# EAGLE design puck (EAGLE 7.5.0)
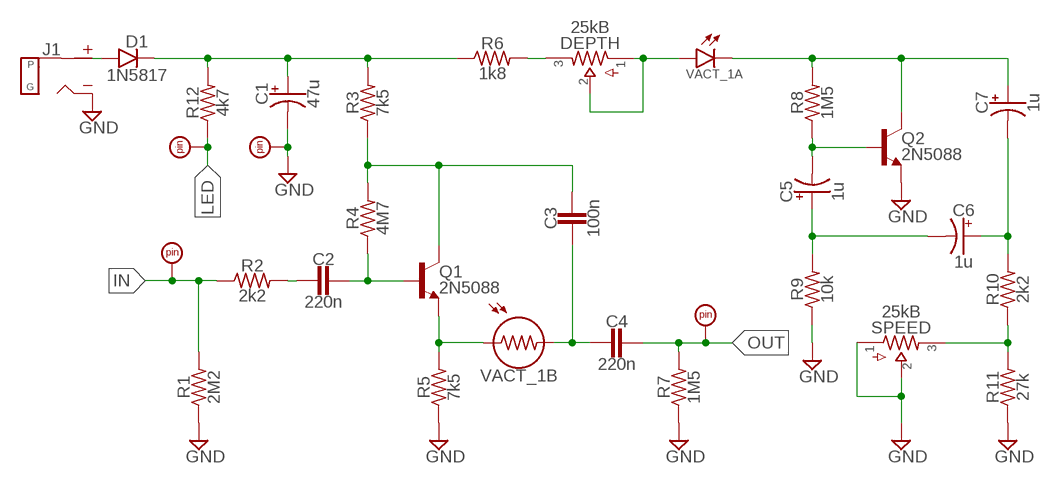
[diagram p0: schematic, sheet 1]

## Parts
C1  47u  0501  [050_020_1]
C2  220n  CER/FILM2  [050X030_025_2]
C3  100n  CER/FILM2  [050X030_025_2]
C4  220n  CER/FILM2  [050X030_025_2]
C5  1u  0500  [050_020]
C6  1u  0500  [050_020]
C7  1u  0500  [050_020]
D1  1N5817  DO41.3  [DO41-3]
DEPTH  25kB  POTSTRIM  [2262_TRIM]
GND  PADRND  [ROUND]
IN  PADSQR  [SQUARE]
J1  DC_MONO  [DC]
LED  PADRND  [ROUND]
OUT  PADSQR  [SQUARE]
Q1  2N5088  [TO92-]
Q2  2N5088  [TO92-]
R1  2M2  R_.3B  [R0207/3]
R2  2k2  R_.3B  [R0207/3]
R3  7k5  R_.3B  [R0207/3]
R4  4M7  R_.3B  [R0207/3]
R5  7k5  R_.3B  [R0207/3]
R6  1k8  R_.3B  [R0207/3]
R7  1M5  R_.3B  [R0207/3]
R8  1M5  R_.3B  [R0207/3]
R9  10k  R_.3B  [R0207/3]
R10  2k2  R_.3B  [R0207/3]
R11  27k  R_.3B  [R0207/3]
R12  4k7  R_.3B  [R0207/3]
SPEED  25kB  POTSSMALL_PADS  [PADS_SMALL]
VACT_1  VACTROL  [_LDR]

## Nets
GND: C1.- GND.1 J1.S(SLEEVE) Q2.3(E) R1.1 R5.1 R7.1 R9.1 R11.1 SPEED.1 SPEED.2
IN: IN.1 R1.2 R2.1
LED: LED.1 R12.1
N$1: D1.A J1.T(TIP)
N$2: C1.+ D1.C R3.2 R6.1 R12.2
N$3: C3.1 Q1.1(C) R3.1 R4.2
N$4: C2.1 Q1.2(B) R4.1
N$5: C7.+ Q2.1(C) R8.2 VACT_1.CATHODE(A:CATHODE)
N$6: C2.2 R2.2
N$7: DEPTH.3 R6.2
N$8: DEPTH.1 DEPTH.2 VACT_1.ANODE(A:ANODE)
N$9: C5.- Q2.2(B) R8.1
N$10: Q1.3(E) R5.2 VACT_1.1
N$11: C3.2 C4.2 VACT_1.2
N$12: C6.+ C7.- R10.2
N$13: C5.+ C6.- R9.2
N$14: R10.1 R11.2 SPEED.3
OUT: C4.1 OUT.1 R7.2

## Library data of the parts
C1 C5-C7 = capacitors-elec:050: 0.22 - 100uF Xicon values at Mouser.com: 10V: 10 - 100uF; 16V: 2.2 - 47uF; 25V: 0.47 - 47uF; 50V: 0.22 - 22uF
C2-C4 = capacitors-film:CER/FILM: 47 - 120pF Xicon Ceramic Disc 2.5mm lead spacing
D1 = diodes:DO41: DO-41 Package Diodes: 1N4001 - 1N40019 Zener Diodes: 1N4728 - 1N4764
DEPTH SPEED = potentiometers:POTS
GND IN LED OUT = supply pins:PAD
J1 = jacks:DC_MONO
Q1 Q2 = transistors:2N5088: NPN Transistor
R1-R12 = resistors:R_
VACT_1 = vactrol:VACTROL

## Board
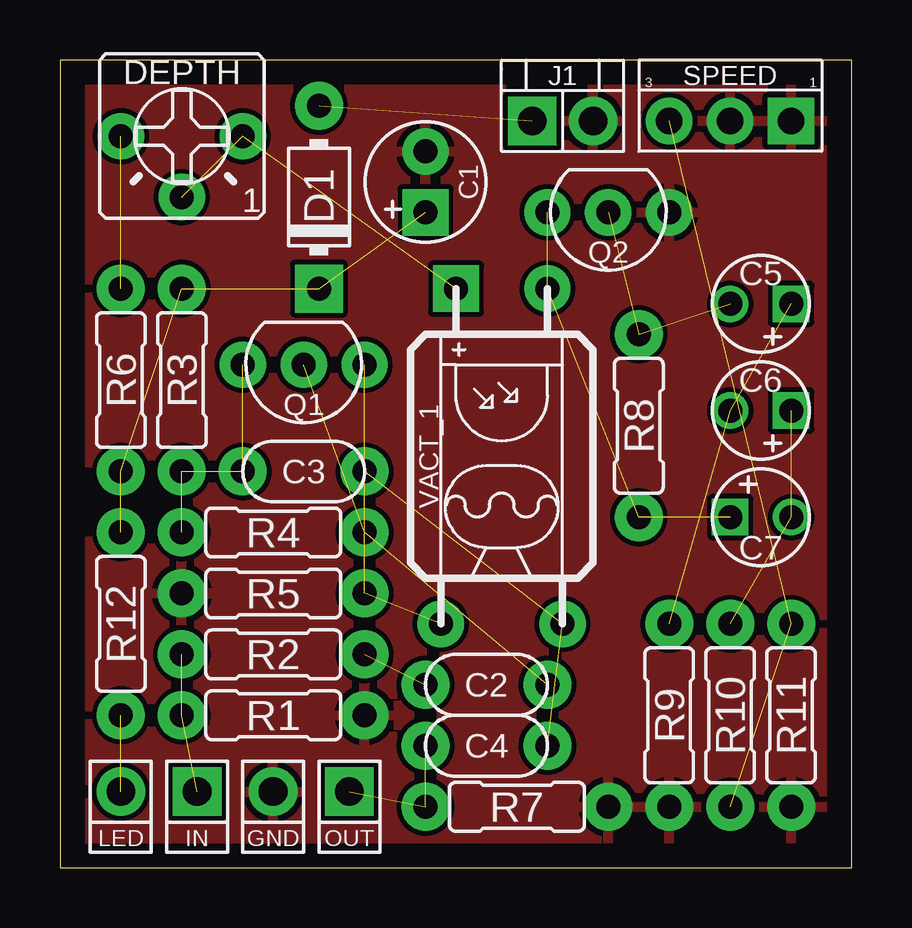
[diagram p1: board, top side]
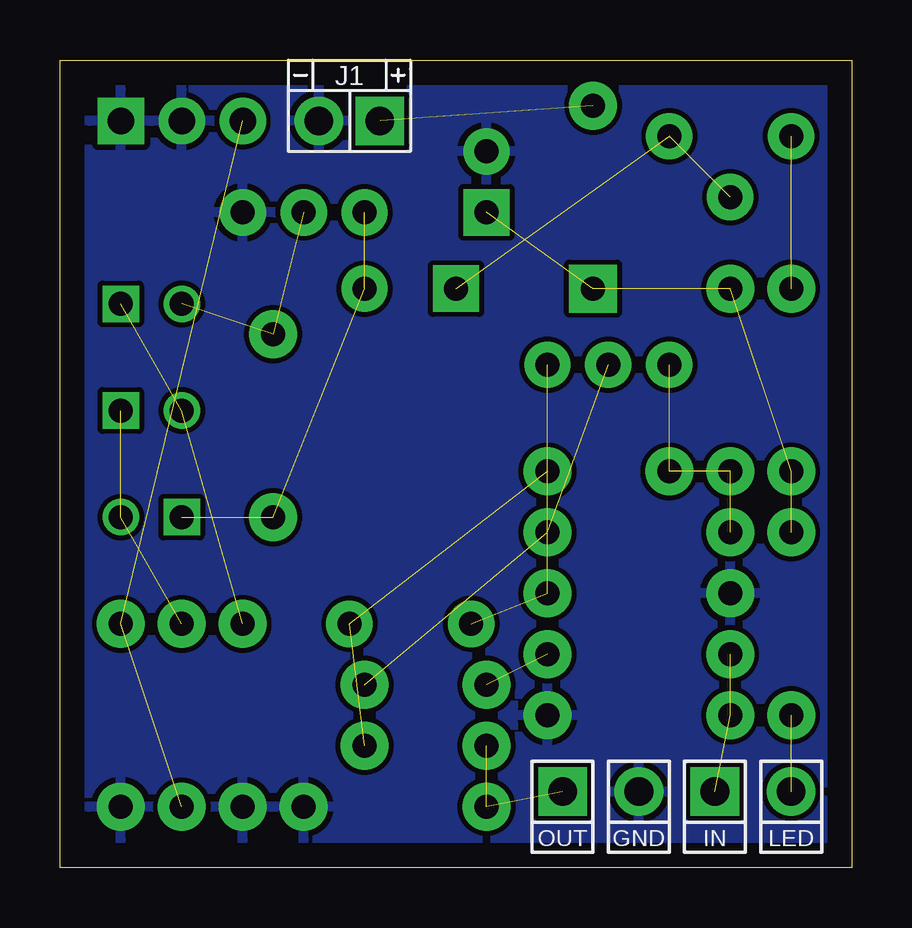
[diagram p2: board, bottom side, seen from below]

Size 33.02 x 33.66 mm. Coordinates in mm from the lower left corner, seen from the top.
Outline: 0,0 33.02,0 33.02,33.66 0,33.66 0,0
Copper layers (1*16): Top 0.035mm / dielectric 1.5mm / Bottom 0.035mm
Design rules "default": minimum track width 10mil, minimum drill 24mil, track to track 8mil, track to pad 8mil, pad to pad 8mil, via to via 8mil, smd to smd 8mil, copper to edge 40mil, drill to drill 8mil, minimum pad ring 10mil, minimum via ring 8mil, stop-mask expansion 4mil, vias tented up to drill 0mil, thermal gap 10mil

### Footprints (pad centres in the part's own frame; a part is rotated, then mirrored left to right if it is on the bottom)
050_020_1 = drill 1 pad 1.93 square: + -1.27,0 | drill 1 pad 1.93: - 1.27,0
050X030_025_2 = drill 1 pad 2: 1 -2.54,0; 2 2.54,0
050_020 = drill 1 pad 1.524 square: + -1.27,0 | drill 1 pad 1.524: - 1.27,0
DO41-3 = drill 1 pad 2: A 3.81,0 | drill 1 pad 2 square: C -3.81,0
2262_TRIM = drill 1 pad 1.93: 1 -2.54,0; 2 0,2.54; 3 2.54,0
ROUND = drill 1.2 pad 2.032: 1 0,0
SQUARE = drill 1.2 pad 2.032 square: 1 0,0
DC = drill 1.2 pad 2.032: S -1.27,0 | drill 1.2 pad 2.032 square: T 1.27,0
TO92- = drill 1 pad 1.93: 1 2.54,0; 2 0,0; 3 -2.54,0
R0207/3 = drill 1 pad 2: 1 -3.81,0; 2 3.81,0
PADS_SMALL = drill 1.1 pad 1.93 square: 1 2.54,0 | drill 1.1 pad 1.93: 2 0,0; 3 -2.54,0
_LDR = drill 1 pad 1.93: 1 -6.985,2.54; 2 -6.985,-2.54; CATHODE 6.985,-1.905 | drill 1 pad 1.93 square: ANODE 6.985,1.905

### Placement (x,y rotation side)
C1  15.24,28.57 90 top
C2  17.78,7.62 180 top
C3  10.16,16.51 0 top
C4  17.78,5.08 0 top
C5  29.21,23.5 180 top
C6  29.21,19.05 180 top
C7  29.21,14.61 0 top
D1  10.79,27.94 90 top
DEPTH  5.08,30.48 180 top
GND  8.89,3.17 0 top
IN  5.71,3.17 0 top
J1  20.95,31.11 0 bottom
LED  2.54,3.17 0 top
OUT  12.06,3.17 0 top
Q1  10.16,20.95 180 top
Q2  22.86,27.3 180 top
R1  8.89,6.35 180 top
R2  8.89,8.89 0 top
R3  5.08,20.32 90 top
R4  8.89,13.97 180 top
R5  8.89,11.43 0 top
R6  2.54,20.32 90 top
R7  19.05,2.54 180 top
R8  24.13,18.41 270 top
R9  25.4,6.35 90 top
R10  27.94,6.35 90 top
R11  30.48,6.35 90 top
R12  2.54,10.16 90 top
SPEED  27.94,31.11 0 top
VACT_1  18.41,17.14 90 top

### Tracks (layer width: path | path; a pad name or v marks a point on that pad's centre or on a via)
GND
  pour Bottom: 0.64,33.02 32.38,33.02 32.38,0.64 0.64,0.64
  pour Top: 0.64,33.02 32.38,33.02 32.38,0.64 0.64,0.64
IN  (2 unrouted)
LED  (1 unrouted)
N$1  (1 unrouted)
N$2  (4 unrouted)
N$3  (3 unrouted)
N$4  (2 unrouted)
N$5  (3 unrouted)
N$6  (1 unrouted)
N$7  (1 unrouted)
N$8  (2 unrouted)
N$9  (2 unrouted)
N$10  (2 unrouted)
N$11  (2 unrouted)
N$12  (2 unrouted)
N$13  (2 unrouted)
N$14  (2 unrouted)
OUT  (2 unrouted)